# Altium schematic sheet mezzanine_card.SchDoc
size A
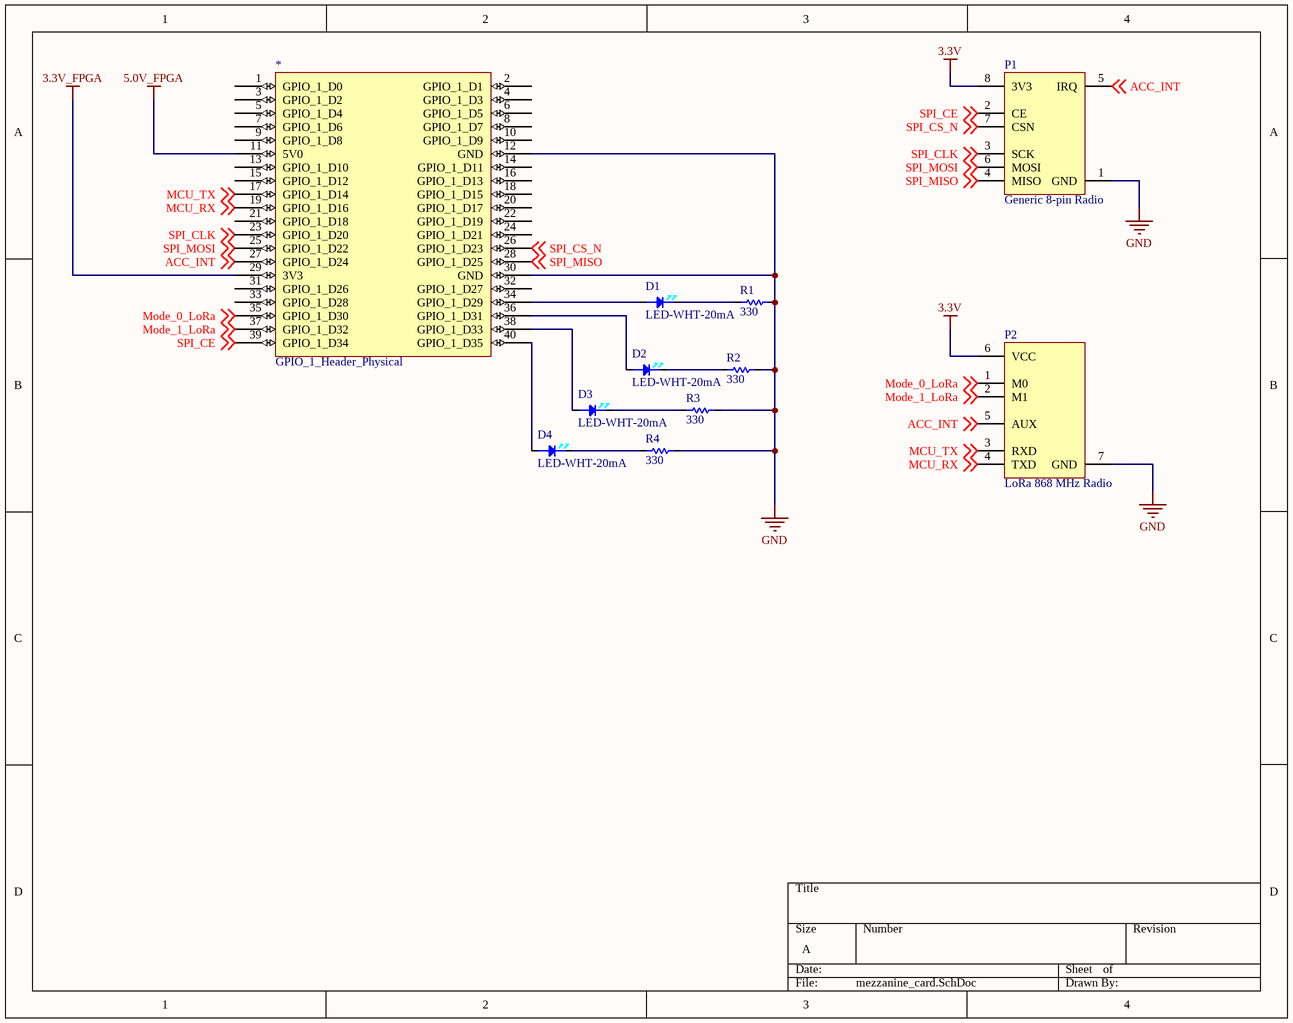
[diagram p0: mezzanine_card.SchDoc]

## Parts
*  GPIO_1_Header_Physical
D1  LED-WHT-20mA  [LED-0805]
D2  LED-WHT-20mA  [LED-0805]
D3  LED-WHT-20mA  [LED-0805]
D4  LED-WHT-20mA  [LED-0805]
P1  Generic 8-pin Radio  [2x4 Radio]
P2  LoRa 868 MHz Radio  [LoRa Breakout]
R1  330  [RES-0805]
R2  330  [RES-0805]
R3  330  [RES-0805]
R4  330  [RES-0805]

## Nets
3.3V: P1.8(3V3) P2.6(VCC)
3.3V_FPGA: *.29(3V3)
5.0V_FPGA: *.11(5V0)
GND: *.12(GND) *.30(GND) P1.1(GND) P2.7(GND) R1.2 R2.2 R3.2 R4.2
ACC_INT: *.27(GPIO_1_D24) P1.5(IRQ) P2.5(AUX) ; off-sheet ACC_INT
MCU_RX: *.19(GPIO_1_D16) P2.4(TXD) ; off-sheet MCU_RX
MCU_TX: *.17(GPIO_1_D14) P2.3(RXD) ; off-sheet MCU_TX
Mode_0_LoRa: *.35(GPIO_1_D30) P2.1(M0) ; off-sheet Mode_0_LoRa
Mode_1_LoRa: *.37(GPIO_1_D32) P2.2(M1) ; off-sheet Mode_1_LoRa
SPI_CE: *.39(GPIO_1_D34) P1.2(CE) ; off-sheet SPI_CE
SPI_CLK: *.23(GPIO_1_D20) P1.3(SCK) ; off-sheet SPI_CLK
SPI_CS_N: *.26(GPIO_1_D23) P1.7(CSN) ; off-sheet SPI_CS_N
SPI_MISO: *.28(GPIO_1_D25) P1.4(MISO) ; off-sheet SPI_MISO
SPI_MOSI: *.25(GPIO_1_D22) P1.6(MOSI) ; off-sheet SPI_MOSI
Net*_34: *.34(GPIO_1_D29) D1.1(CT)
Net*_36: *.36(GPIO_1_D31) D2.1(CT)
Net*_38: *.38(GPIO_1_D33) D3.1(CT)
Net*_40: *.40(GPIO_1_D35) D4.1(CT)
NetD1_2: D1.2(AN) R1.1
NetD2_2: D2.2(AN) R2.1
NetD3_2: D3.2(AN) R3.1
NetD4_2: D4.2(AN) R4.1

Not connected (* = marked no-connect by the designer): * 1(GPIO_1_D0) 2(GPIO_1_D1) 3(GPIO_1_D2) 4(GPIO_1_D3) 5(GPIO_1_D4) 6(GPIO_1_D5) 7(GPIO_1_D6) 8(GPIO_1_D7) 9(GPIO_1_D8) 10(GPIO_1_D9) 13(GPIO_1_D10) 14(GPIO_1_D11) 15(GPIO_1_D12) 16(GPIO_1_D13) 18(GPIO_1_D15) 20(GPIO_1_D17) 21(GPIO_1_D18) 22(GPIO_1_D19) 24(GPIO_1_D21) 31(GPIO_1_D26) 32(GPIO_1_D27) 33(GPIO_1_D28)

## Library data of the parts
D1-D4 = LED-WHT-20mA: 2.2V, 0805; ComponentLink1Description: Resistor Book (Amazon); ComponentLink1URL: https://www.amazon.com/gp/product/B071J21FYF/; Supplier 1: Digi-Key; Supplier Part Number 1: 475-1410-1-ND
P1 = Generic 8-pin Radio: SPI Interface, 0.1" Pitch 2x4; ComponentLink1Description: 2.4 GHz Ext. Ant. 2300M (Amazon); ComponentLink1URL: https://www.amazon.com/gp/product/B07BNDKFXP/; ComponentLink2Description: 2.4 GHz Ext. Ant 1100M (Amazon); ComponentLink2URL: https://www.amazon.com/gp/product/B01IK78PQA/
P2 = 868 MHz SX1276 LoRa Breakout: UART Interface, 0.1" Pitch; ComponentLink1Description: Amazon; ComponentLink1URL: https://www.amazon.com/gp/product/B07GPLJTWD/
R1-R4 = RES-330-1/8W: 0805; ComponentLink1Description: Resistor Book (Amazon); ComponentLink1URL: https://www.amazon.com/gp/product/B071J21FYF/